# Altium schematic sheet 1986BE1T_MC.SchDoc
size 420 x 594 mm; Scale: 1:1; Разраб.: Иванов; Обозначение документа: АБВГ.123456.001 Э3; Пров.: Петров; Утв.: Сидоров; Наименование организации: ОАО "Концерн "МПО-Гидроприбор"; Перв. применение: АБВГ.123456.000; Наименование изделия 1: Плата; Наименование изделия 2: Схема электрическая; Наименование изделия 3: принципиальная; Нач. отд.: Нач. отд.; Фамилия нач. отд.: Сидоров
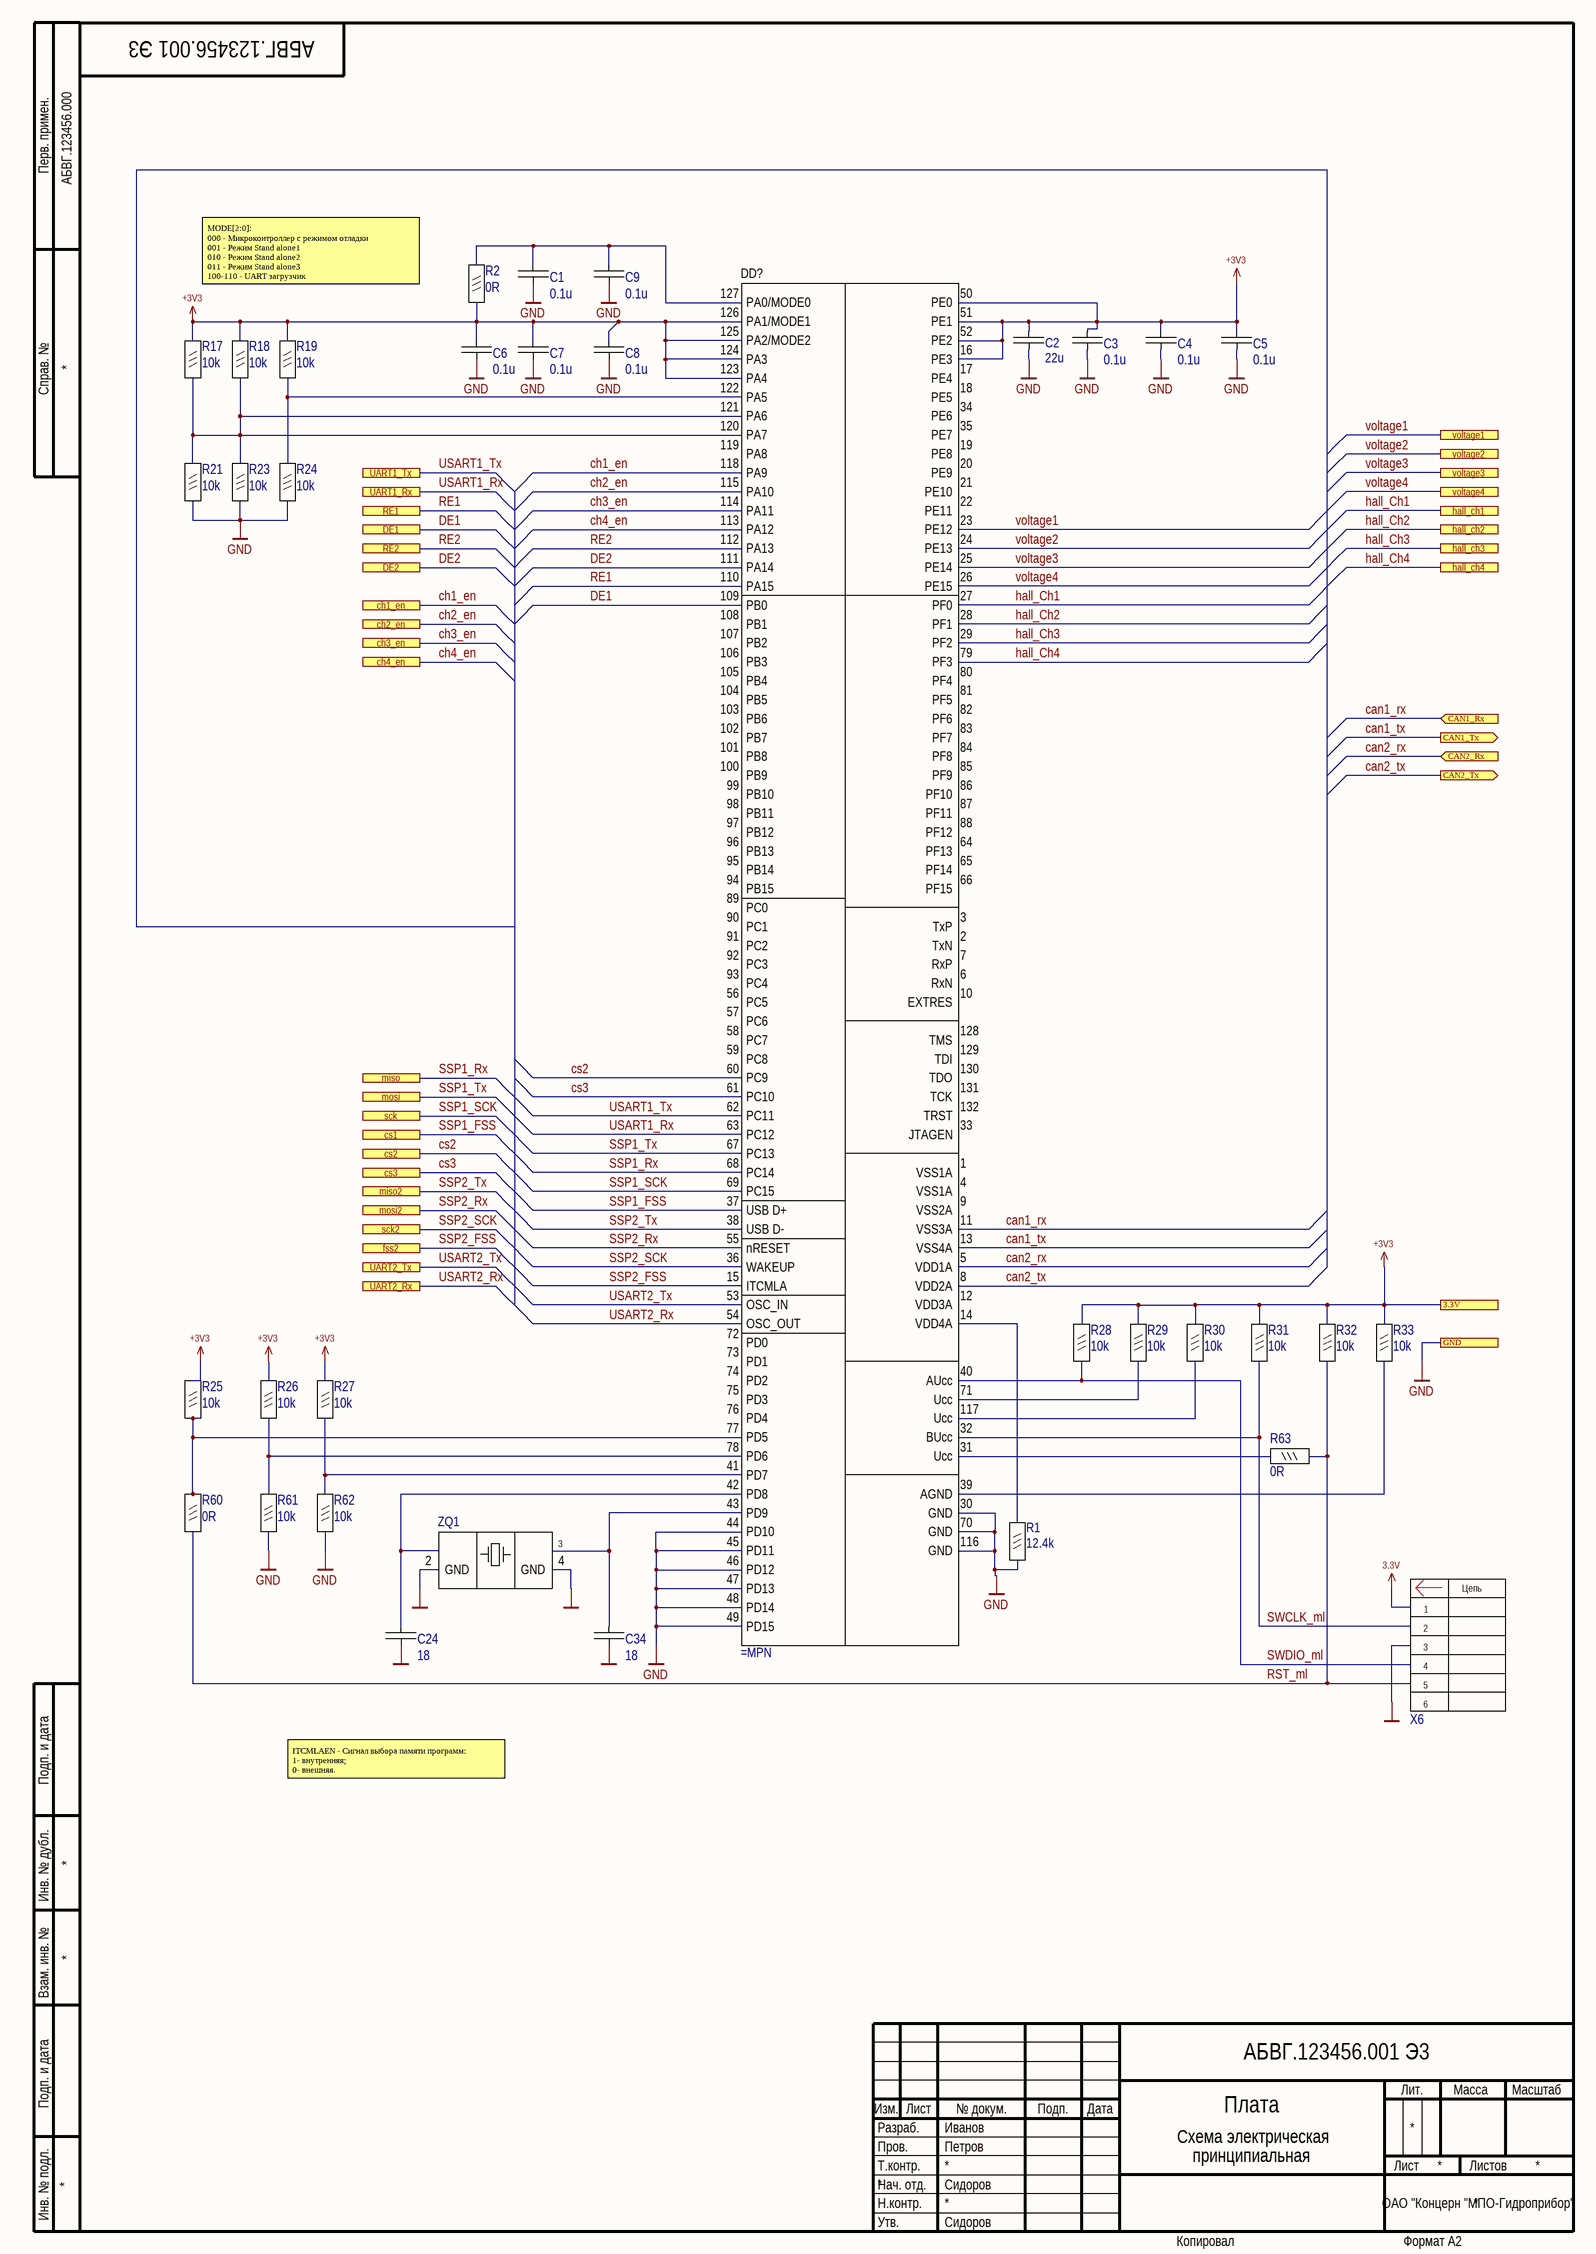
[diagram p0: 1986BE1T_MC.SchDoc]

## Parts
C1  0.1u  [C0603_IPC]
C2  22u  [C0805_IPC]
C3  0.1u  [C0603_IPC]
C4  0.1u  [C0603_IPC]
C5  0.1u  [C0603_IPC]
C6  0.1u  [C0603_IPC]
C7  0.1u  [C0603_IPC]
C8  0.1u  [C0603_IPC]
C9  0.1u  [C0603_IPC]
C24  18  [C0603_IPC]
C34  18  [C0603_IPC]
DD?  (no value)
R1  12.4k  [R0603]
R2  0R  [R0603]
R17  10k  [R0603]
R18  10k  [R0603]
R19  10k  [R0603]
R21  10k  [R0603]
R23  10k  [R0603]
R24  10k  [R0603]
R25  10k  [R0603]
R26  10k  [R0603]
R27  10k  [R0603]
R28  10k  [R0603]
R29  10k  [R0603]
R30  10k  [R0603]
R31  10k  [R0603]
R32  10k  [R0603]
R33  10k  [R0603]
R60  0R  [R0603]
R61  10k  [R0603]
R62  10k  [R0603]
R63  0R  [R0603]
X6  PLS-6  [PLS-6]  (value not drawn)
ZQ1  ABM3C-25.000MHZ_4pin  [5x3.2]  (value not drawn)

## Ports
3.3V, CAN1_Rx (in), CAN1_Tx (out), CAN2_Rx (in), CAN2_Tx (out), ch1_en, ch2_en, ch3_en, ch4_en, cs1, cs2, cs3, DE1, DE2, fss2, GND, hall_ch1, hall_ch2, hall_ch3, hall_ch4, miso, miso2, mosi, mosi2, RE1, RE2, sck, sck2, UART1_Rx, UART1_Tx, UART2_Rx, UART2_Tx, voltage1, voltage2, voltage3, voltage4

## Nets
3.3V: X6.1
+3V3: C2.1 C3.1 C4.1 C5.1 C6.1 C7.1 C8.1 DD?.16(PE3) DD?.50(PE0) DD?.51(PE1) DD?.52(PE2) DD?.123(PA4) DD?.124(PA3) DD?.125(PA2/MODE2) DD?.126(PA1/MODE1) R2.1 R17.2 R18.2 R19.2 R25.2 R26.1 R27.1 R28.2 R29.2 R30.2 R31.2 R32.2 R33.2 ; port 3.3V
GND: C1.2 C2.2 C3.2 C4.2 C5.2 C6.2 C7.2 C8.2 C9.2 C24.2 C34.2 DD?.30(GND) DD?.44(PD10) DD?.45(PD11) DD?.46(PD12) DD?.47(PD13) DD?.48(PD14) DD?.49(PD15) DD?.70(GND) DD?.116(GND) R1.1 R21.1 R23.1 R24.1 R61.2 R62.2 X6.3 ZQ1.2(GND) ZQ1.4(GND) ; port GND
can1_rx: DD?.11(VSS3A) ; port CAN1_Rx
can1_tx: DD?.13(VSS4A) ; port CAN1_Tx
can2_rx: DD?.5(VDD1A) ; port CAN2_Rx
can2_tx: DD?.8(VDD2A) ; port CAN2_Tx
ch1_en: DD?.118(PA9) ; port ch1_en
ch2_en: DD?.115(PA10) ; port ch2_en
ch3_en: DD?.114(PA11) ; port ch3_en
ch4_en: DD?.113(PA12) ; port ch4_en
cs2: DD?.60(PC9) ; port cs2
cs3: DD?.61(PC10) ; port cs3
DE1: DD?.109(PB0) ; port DE1
DE2: DD?.111(PA14) ; port DE2
hall_Ch1: DD?.27(PF0) ; port hall_ch1
hall_Ch2: DD?.28(PF1) ; port hall_ch2
hall_Ch3: DD?.29(PF2) ; port hall_ch3
hall_Ch4: DD?.79(PF3) ; port hall_ch4
RE1: DD?.110(PA15) ; port RE1
RE2: DD?.112(PA13) ; port RE2
RST_ml: R32.1 R60.1 R63.2 X6.5
SSP1_FSS: DD?.37(USB_D+) ; port cs1
SSP1_Rx: DD?.68(PC14) ; port miso
SSP1_SCK: DD?.69(PC15) ; port sck
SSP1_Tx: DD?.67(PC13) ; port mosi
SSP2_FSS: DD?.15(ITCMLA) ; port fss2
SSP2_Rx: DD?.55(nRESET) ; port mosi2
SSP2_SCK: DD?.36(WAKEUP) ; port sck2
SSP2_Tx: DD?.38(USB_D-) ; port miso2
SWCLK_ml: DD?.32(BUcc) R31.1 X6.2
SWDIO_ml: DD?.40(AUcc) R28.1 X6.4
USART1_Rx: DD?.63(PC12) ; port UART1_Rx
USART1_Tx: DD?.62(PC11) ; port UART1_Tx
USART2_Rx: DD?.54(OSC_OUT) ; port UART2_Rx
USART2_Tx: DD?.53(OSC_IN) ; port UART2_Tx
voltage1: DD?.23(PE12) ; port voltage1
voltage2: DD?.24(PE13) ; port voltage2
voltage3: DD?.25(PE14) ; port voltage3
voltage4: DD?.26(PE15) ; port voltage4
NetC1_1: C1.1 C9.1 DD?.127(PA0/MODE0) R2.2
NetC24_1: C24.1 DD?.42(PD8) ZQ1.1
NetC34_1: C34.1 DD?.43(PD9) ZQ1.3
NetDD?_14: DD?.14(VDD4A) R1.2
NetDD?_31: DD?.31(Ucc) R63.1
NetDD?_39: DD?.39(AGND) R33.1
NetDD?_41: DD?.41(PD7) R27.2 R62.1
NetDD?_71: DD?.71(Ucc) R29.1
NetDD?_77: DD?.77(PD5) R25.1 R60.2
NetDD?_78: DD?.78(PD6) R26.2 R61.1
NetDD?_117: DD?.117(Ucc) R30.1
NetDD?_120: DD?.120(PA7) DD?.121(PA6) R17.1 R18.1 R21.2 R23.2
NetDD?_122: DD?.122(PA5) R19.1 R24.2

Not connected (* = marked no-connect by the designer): DD? 1(VSS1A) 2(TxN) 3(TxP) 4(VSS1A) 6(RxN) 7(RxP) 9(VSS2A) 10(EXTRES) 12(VDD3A) 17(PE4) 18(PE5) 19(PE8) 20(PE9) 21(PE10) 22(PE11) 33(JTAGEN) 34(PE6) 35(PE7) 56(PC5) 57(PC6) 58(PC7) 59(PC8) 64(PF13) 65(PF14) 66(PF15) 72(PD0) 73(PD1) 74(PD2) 75(PD3) 76(PD4) 80(PF4) 81(PF5) 82(PF6) 83(PF7) 84(PF8) 85(PF9) 86(PF10) 87(PF11) 88(PF12) 89(PC0) 90(PC1) 91(PC2) 92(PC3) 93(PC4) 94(PB15) 95(PB14) 96(PB13) 97(PB12) 98(PB11) 99(PB10) 100(PB9) 101(PB8) 102(PB7) 103(PB6) 104(PB5) 105(PB4) 106(PB3) 107(PB2) 108(PB1) 119(PA8) 128(TMS) 129(TDI) 130(TDO) 131(TCK) 132(TRST); X6 6

## Notes on the sheet
- MODE[2:0]:
  000 - Микроконтроллер с режимом отладки
  001 - Режим Stand alone1
  010 - Режим Stand alone2
  011 - Режим Stand alone3
  100-110 - UART загрузчик
- ITCMLAEN - Сигнал выбора памяти программ:
  1- внутренняя;
  0- внешняя.
- Перв. примен.
- Справ. №
- Подп. и дата
- Инв. № дубл.
- Взам. инв. №
- Разраб.
- Изм.
- Лист
- № докум.
- Подп.
- Дата
- Лит.
- Масса
- Масштаб
- Пров.
- Т.контр.
- Листов
- Инв. № подл.
- Утв.
- Н.контр.
- Копировал
- Формат А2
- (in symbol PLS-6) Цепь; 3 /; 6 /

## Library data of the parts
C1 C3-C9 = 0.1u 50V: 0.1uF ±10% 50V Ceramic Capacitor X7R 0603 (1608 Metric); MPN: CL10B104KB8NNND; Manufacturer: Samsung; Tolerance: 0,1; PartNumber: 0.1u 50V; Value: 0.1u; Voltage/Power: 50V; LibraryPath: _library\sch\cap.schlib; FootprintPath: _library\pcb\capSmd.pcblib; ComponentLink2URL: https://www.digikey.com/product-detail/en/yageo/CC0603KRX7R9BB104/311-1344-2-ND/2103082; ComponentLink2Description: site; Type: X7R; price elitan 1000pc: 0.63; price terra 1000pc: 0.65
C2 = 22u 6.3V: 22µF ±20% 6.3V Ceramic Capacitor X5R 0805 (2012 Metric); MPN: CL21A226MQQNNNE; Manufacturer: Samsung Electro-Mechanics; Tolerance: 0,2; Name: 22u 6.3V; Value: 22u; Voltage/Power: 6.3V; LibraryPath: sch\cap.schlib; FootprintPath: pcb\capSmd.pcblib; ComponentLink2URL: https://www.digikey.com/product-detail/en/samsung-electro-mechanics/CL21A226MQQNNNE/1276-1100-2-ND/3886758; ComponentLink2Description: site; Type: X5R; price elitan 1000pc: 1.67; price terra 1000pc: 1.6
C24 C34 = 18p 50V: 18pF ±5% 50V Ceramic Capacitor C0G, NP0 0603 (1608 Metric); MPN: CC0603JRNPO9BN180; Manufacturer: Yageo; Name: 18p 50V; Tolerance: 0,05; Type: C0G/NPO; Value: 18; Voltage/Power: 50V; LibraryPath: _library\sch\cap.schlib; FootprintPath: _library\pcb\capSmd.pcblib; ComponentLink2URL: https://www.digikey.com/product-detail/en/yageo/CC0603JRNPO9BN180/311-1061-2-ND/302795; ComponentLink2Description: site; price elitan 1000pc: 0.62; price terra 1000pc: 0.65
DD? = 1986ВЕ1Т_132: 32-разрядный RISC-микроконтроллер для авиационных применений
R1 = 12k4 1%: 12.4 kOhms ±1% 0.1W, 1/10W Chip Resistor 0603 (1608 Metric) Moisture Resistant Thick Film; MPN: RC0603FR-0712K4L; Manufacturer: yageo; Name: 12k4 1%; Voltage/Power: 0.063; Value: 12.4k; Tolerance: 1%; ComponentLink2URL: https://www.digikey.com/product-detail/en/yageo/RC0603FR-0712K4L/311-12.4KHRTR-ND/726917; ComponentLink2Description: site; price elitan 1000pc: 0.08; price terra 1000pc: 0.22; price chipdip 1000pc: 0.09; LibraryPath: sch\res.Schlib; FootprintPath: pcb\resSmd.pcblib
R2 R60 R63 = 0R: 0 Ohms Jumper 0.1W, 1/10W Chip Resistor 0603 (1608 Metric) Moisture Resistant Thick Film; MPN: RC0603FR-070RL; Manufacturer: yageo; Voltage/Power: 0.063; Name: 0R; Value: 0R; Tolerance: Jumper; ComponentLink2URL: https://www.digikey.com/product-detail/en/yageo/RC0603FR-070RL/311-0.0HRTR-ND/1304008; ComponentLink2Description: site; price elitan 1000pc: 0.26; price terra 1000pc: 0.23; LibraryPath: _library\sch\; FootprintPath: _library\pcb\resSmd.pcblib
R17-R19 R21 R23-R33 R61 R62 = 10k 1%: RES SMD 10k OHM 1% 1/10W 0603; PartNumber: 10k 1%; MPN: RC0603FR-0710KL; Manufacturer: yageo; Voltage/Power: 0.063; Value: 10k; Tolerance: 1%; ComponentLink2URL: https://www.digikey.com/product-detail/en/yageo/RC0603FR-0710KL/311-10.0KHRTR-ND/726880; ComponentLink2Description: site; price elitan 1000pc: 0.19; price terra 1000pc: 0.22; LibraryPath: _library\sch\; FootprintPath: _library\pcb\resSmd.pcblib
X6 = PLS-6: Connector Header Through Hole 6 position 0.100" (2.54mm); Manufacturer: Connfly; analogue: 2211S-06G (PLS-06), DS1021-1x6 SF11, 825433-6; Voltage/Power: 250VAC/3A; Name: PLS-6; MPN: PLS-6; ComponentLink2URL: http://www.connfly.com/userfiles/image/UpLoadFile/File/2015/1/29/DS1021.pdf; ComponentLink2Description: site; price elitan 1000pc: 0.93; price terra 1000pc: 1.1; price dart 1000pc: 4.39
ZQ1 = ABM3C-25.000MHZ_4pin: CRYSTAL 25.0000MHZ 18PF SMD, 4Pin; Name: ABM3C-25.000MHZ_4pin; MPN: ABM3C-25.000MHZ_4pin; Value: 25.000MHZ; ComponentLink2URL: http://www.geyer-electronic.de/uploads/tx_userartikelfrequenz/GEYER-KX-9A_12.pdf; ComponentLink2Description: site; Library Path: sch\crystal.schlib; ComponentLink3URL: D:\_library\pdf\connectors\sd\C0644-08DASNBRR(I0361).pdf; ComponentLink3Description: hsuan mao; ComponentLink4URL: D:\_library\pdf\connectors\sd\ds1139-06.pdf; ComponentLink4Description: connfly